# Altium schematic sheet Memory.SchDoc
size A
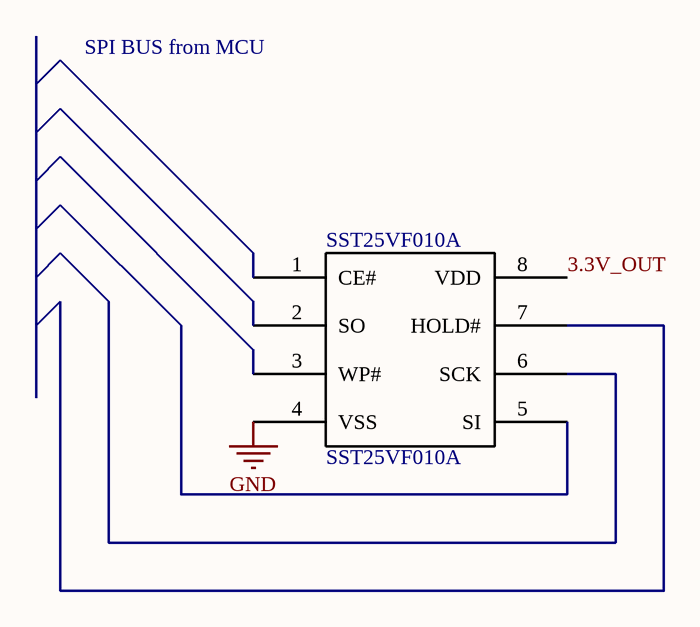
[diagram p0: Memory.SchDoc]

## Parts
SST25VF010A  SST25VF010A  [SST25VF010A]

## Nets
GND: SST25VF010A.4(VSS)
3.3V_OUT: SST25VF010A.8(VDD)

Not connected (* = marked no-connect by the designer): SST25VF010A 1(CE#) 2(SO) 3(WP#) 5(SI) 6(SCK) 7(HOLD#)

## Notes on the sheet
- SPI BUS from MCU